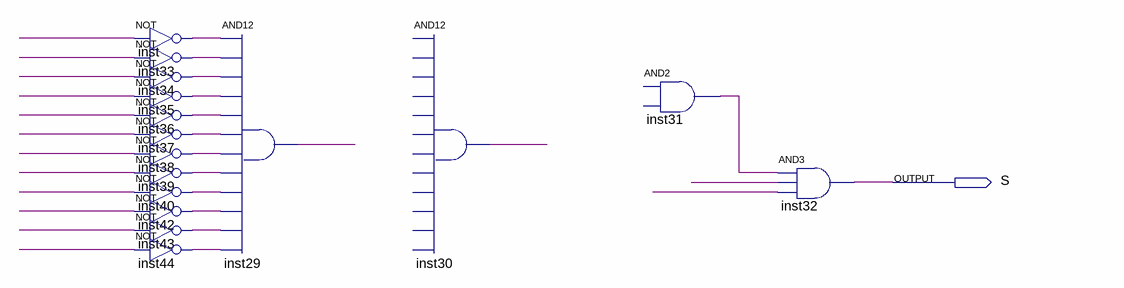
[diagram p0: schematic sheet]
// Quartus schematic Mux_decodificador.bdf as structural Verilog: 16 symbols, 1 pins
module Mux_decodificador (
  output S
);

  wire inst29_out, inst30_out, inst31_out, inst33_out, inst34_out, inst35_out, inst36_out, inst37_out,
       inst38_out, inst39_out, inst40_out, inst42_out, inst43_out, inst44_out, inst_out, undriven,
       undriven_2, undriven_3, undriven_4, undriven_5, undriven_6, undriven_7, undriven_8, undriven_9,
       undriven_10, undriven_11, undriven_12, undriven_13, undriven_14;

  not inst (inst_out, undriven_3);
  not inst33 (inst33_out, undriven_4);
  not inst34 (inst34_out, undriven_5);
  not inst35 (inst35_out, undriven_6);
  not inst36 (inst36_out, undriven_7);
  not inst37 (inst37_out, undriven_8);
  not inst38 (inst38_out, undriven_9);
  not inst39 (inst39_out, undriven_10);
  not inst40 (inst40_out, undriven_11);
  not inst42 (inst42_out, undriven_12);
  not inst43 (inst43_out, undriven_13);
  not inst44 (inst44_out, undriven_14);
  and inst29 (inst29_out, inst_out, inst33_out, inst34_out, inst35_out, inst36_out, inst37_out, inst38_out, inst39_out, inst40_out, inst42_out, inst43_out, inst44_out);
  // AND12 inst30 has open pins: IN1=open, IN2=open, IN3=open, IN4=open, IN5=open, IN6=open, IN7=open, IN8=open, IN9=open, IN10=open, IN11=open, IN12=open, OUT=inst30_out
  // AND2 inst31 has open pins: IN1=open, IN2=open, OUT=inst31_out
  and inst32 (S, inst31_out, undriven_2, undriven);
endmodule
